# Altium schematic sheet CPU.SchDoc
size A4; SheetNumber: 2; SheetTotal: 2
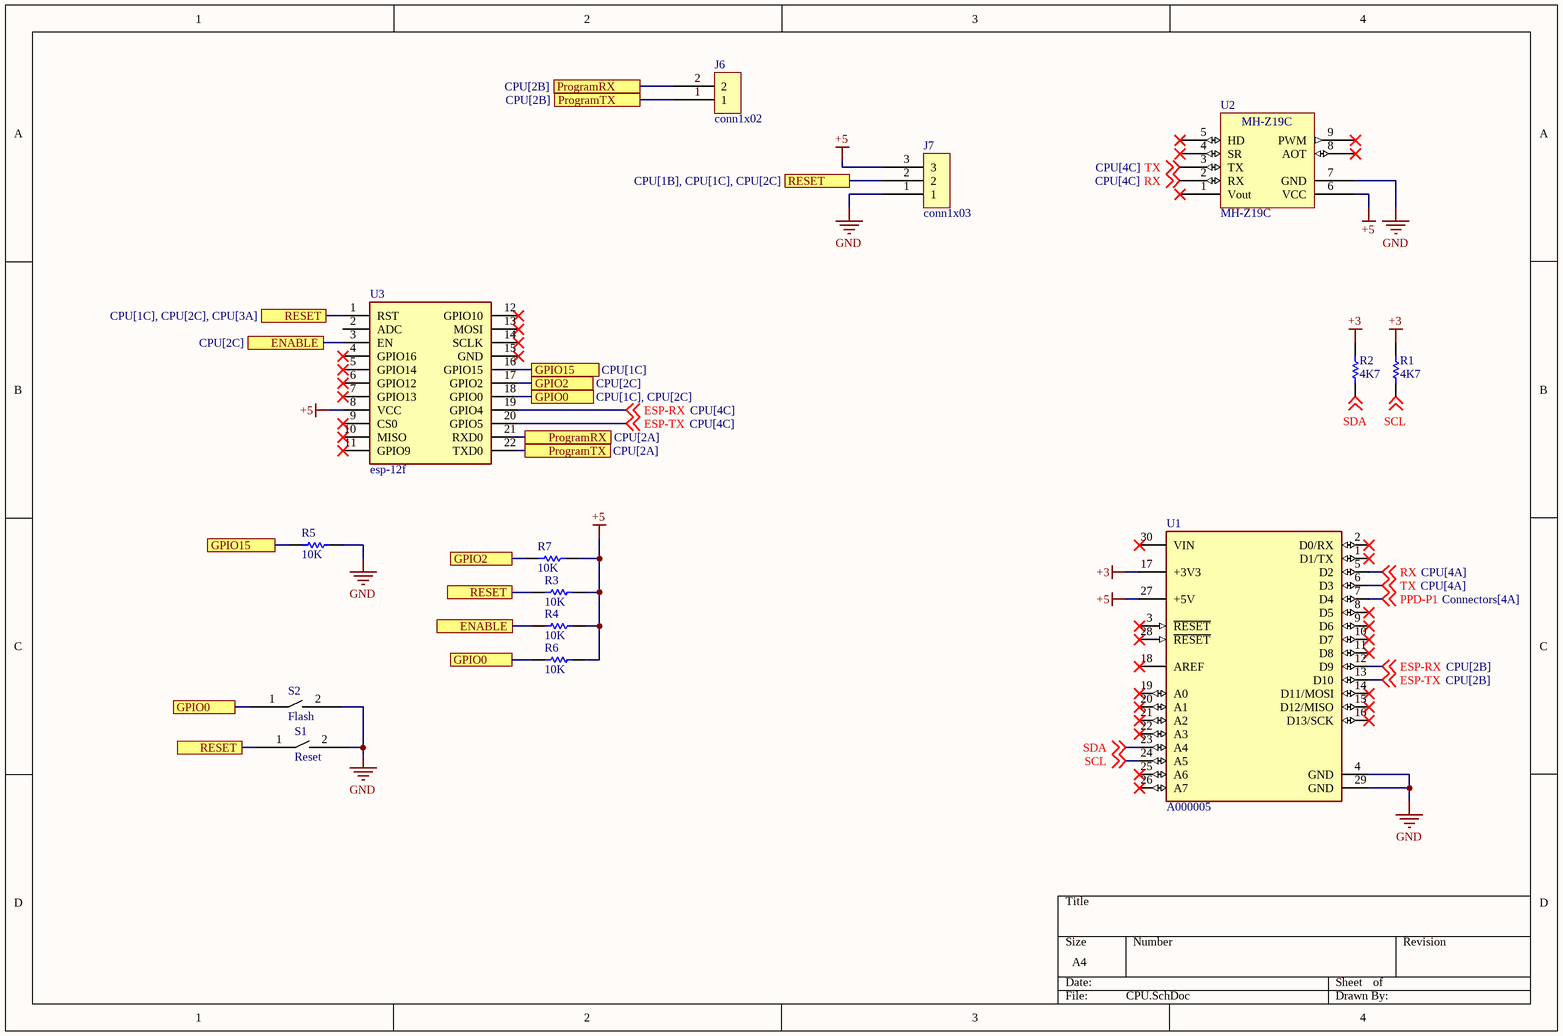
[diagram p0: CPU.SchDoc]

## Parts
J6  conn1x02  [conn1x02]
J7  conn1x03  [conn1x03]
R1  4K7  [1206]
R2  4K7  [1206]
R3  10K  [RESC2013X70X40ML20T20]
R4  10K  [RESC2013X70X40ML20T20]
R5  10K  [RESC2013X70X40ML20T20]
R6  10K  [RESC2013X70X40ML20T20]
R7  10K  [RESC2013X70X40ML20T20]
S1  Reset  [Switch]
S2  Flash  [Switch]
U1  A000005  [FP-A000005-MFG]
U2  MH-Z19C  [MH-Z19]
U3  esp-12f  [esp12f]

## Ports
ENABLE (see CPU[1B]), ENABLE (see CPU[2C]), GPIO0 (see CPU[1C], CPU[2B]), GPIO0 (see CPU[1C], CPU[2C]), GPIO0 (see CPU[2B], CPU[2C]), GPIO2 (see CPU[2B]), GPIO2 (see CPU[2C]), GPIO15 (see CPU[1C]), GPIO15 (see CPU[2B]), ProgramRX (see CPU[2A]), ProgramRX (see CPU[2B]), ProgramTX (see CPU[2A]), ProgramTX (see CPU[2B]), RESET (see CPU[1B], CPU[1C], CPU[2C]), RESET (see CPU[1B], CPU[1C], CPU[3A]), RESET (see CPU[1B], CPU[2C], CPU[3A]), RESET (see CPU[1C], CPU[2C], CPU[3A])

## Nets
+3: R1.2 R2.2 U1.17(+3V3)
+5: J7.3 R3.2 R4.2 R6.2 R7.2 U1.27(+5V) U2.6(VCC) U3.8(VCC)
GND: J7.1 R5.2 S1.2 S2.2 U1.4(GND) U1.29(GND) U2.7(GND)
ENABLE: R4.1 U3.3(EN) ; port ENABLE
ESP-RX: U1.12(D9) U3.19(GPIO4) ; off-sheet ESP-RX
ESP-TX: U1.13(D10) U3.20(GPIO5) ; off-sheet ESP-TX
GPIO0: R6.1 S2.1 U3.18(GPIO0) ; port GPIO0
GPIO2: R7.1 U3.17(GPIO2) ; port GPIO2
GPIO15: R5.1 U3.16(GPIO15) ; port GPIO15
PPD-P1: U1.7(D4) ; off-sheet PPD-P1
ProgramRX: J6.2 U3.21(RXD0) ; port ProgramRX
ProgramTX: J6.1 U3.22(TXD0) ; port ProgramTX
RESET: J7.2 R3.1 S1.1 U3.1(RST) ; port RESET
RX: U1.5(D2) U2.2(RX) ; off-sheet RX
SCL: R1.1 U1.24(A5) ; off-sheet SCL
SDA: R2.1 U1.23(A4) ; off-sheet SDA
TX: U1.6(D3) U2.3(TX) ; off-sheet TX

Not connected (* = marked no-connect by the designer): U1 1(D1/TX)* 2(D0/RX)* 3(~{RESET})* 8(D5)* 9(D6)* 10(D7)* 11(D8)* 14(D11/MOSI)* 15(D12/MISO)* 16(D13/SCK)* 18(AREF)* 19(A0)* 20(A1)* 21(A2)* 22(A3)* 25(A6)* 26(A7)* 28(~{RESET})* 30(VIN)*; U2 1(Vout)* 4(SR)* 5(HD)* 8(AOT)* 9(PWM)*; U3 2(ADC) 4(GPIO16)* 5(GPIO14)* 6(GPIO12)* 7(GPIO13)* 9(CS0)* 10(MISO)* 11(GPIO9)* 12(GPIO10)* 13(MOSI)* 14(SCLK)* 15(GND)*

## Library data of the parts
R1 R2 = CMP-2001-04375-5: Manufacturer: Panasonic; Voltage Rating: 150 V; ComponentLink1URL: http://www.panasonic.com/; ComponentLink2Description: Datasheet; REACH SVHC: Yes; ComponentLink1Description: Manufacturer URL; Length: 2 mm; Height: 0.6 mm; Package Quantity: 1; PackageDescription: 2-Pin Surface Mount Device, Body 2 x 1.25 mm; Packaging: Cut Tape; PackageReference: 0805; Max Operating Temperature: 155 degC; Mounting Technology: Surface Mount; ComponentLink2URL: http://industrial.panasonic.com/cdbs/www-data/pdf/RDA0000/AOA0000C86.pdf; DatasheetVersion: 04/2015; Min Operating Temperature: -55 degC; RoHSCompliant: true; Mount: Surface Mount
R3-R7 = CMP-2001-04375-5: Chip Resistor, 1 KOhm, +/- 1%, 0.125 W, -55 to 155 degC, 0805 (2012 Metric), RoHS, Tape and Reel; Manufacturer: Panasonic; Voltage Rating: 150 V; ComponentLink1URL: http://www.panasonic.com/; ComponentLink2Description: Datasheet; REACH SVHC: Yes; ComponentLink1Description: Manufacturer URL; Length: 2 mm; Height: 0.6 mm; Package Quantity: 1; PackageDescription: 2-Pin Surface Mount Device, Body 2 x 1.25 mm; Packaging: Cut Tape; PackageReference: 0805; Max Operating Temperature: 155 degC; Mounting Technology: Surface Mount; ComponentLink2URL: http://industrial.panasonic.com/cdbs/www-data/pdf/RDA0000/AOA0000C86.pdf; DatasheetVersion: 04/2015; Min Operating Temperature: -55 degC; RoHSCompliant: true; Mount: Surface Mount
S1 S2 = Switch
U1 = CMP-189986-000002-1: ARDUINO NANO ATMEGA328 EVAL BRD; Number of Bits: 8; Evaluation Kit: Yes; Operating Supply Voltage: 12V; Interface: I2C; Data Bus Width: 8b; Core Architecture: AVR; Packaging: Bulk; Length: 7inch; Package Quantity: 50; Width: 5inch; REACH SVHC: No SVHC; Weight: 0.358383oz; Series: AVR® ATmega; Height: 0.25inch
U3 = esp-12f: Integrated Circuit; Manufacturer_Name: Ai-Thinker; Datasheet Link: https://docs.ai-thinker.com/_media/esp8266/docs/esp-12f_product_specification_en.pdf; Height: 3.1mm; Manufacturer_Part_Number: esp-12f